# Altium schematic sheet 基板1.SchDoc
size A4
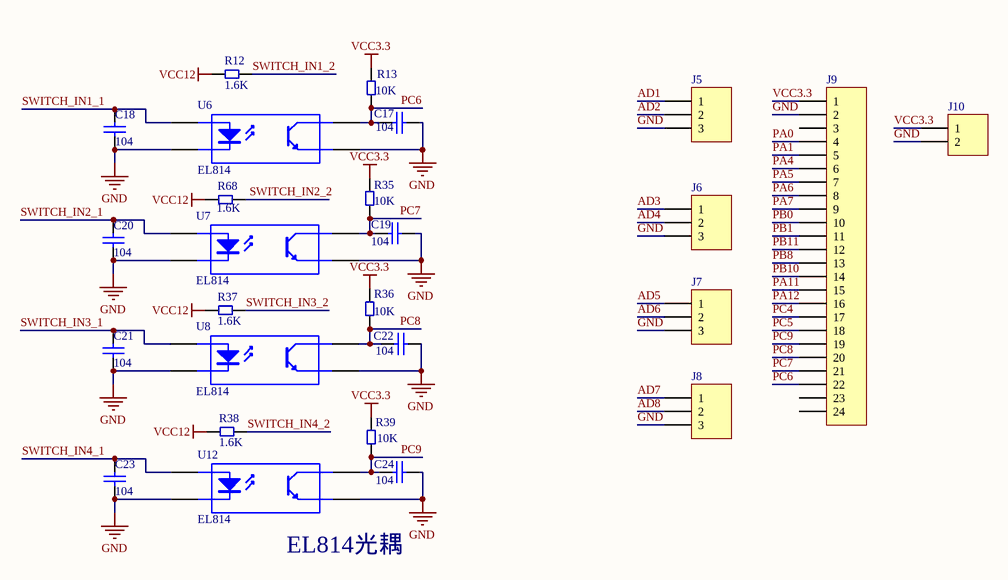
[diagram p0: 基板1.SchDoc]

## Parts
C17  value 104  [0805C]
C18  value 104  [0805C]
C19  value 104  [0805C]
C20  value 104  [0805C]
C21  value 104  [0805C]
C22  value 104  [0805C]
C23  value 104  [0805C]
C24  value 104  [0805C]
J5  Header 3  [J5_3P]  (value not drawn)
J6  Header 3  [J5_3P]  (value not drawn)
J7  Header 3  [J5_3P]  (value not drawn)
J8  Header 3  [J5_3P]  (value not drawn)
J9  Header 24  [ffc]  (value not drawn)
J10  Header 2  [HDR1X2]  (value not drawn)
R12  1.6K  [0805]
R13  10K  [0805]
R35  10K  [0805]
R36  10K  [0805]
R37  1.6K  [0805]
R38  1.6K  [0805]
R39  10K  [0805]
R68  1.6K  [0805]
U6  EL814  [SOP4]
U7  EL814  [SOP4]
U8  EL814  [SOP4]
U12  EL814  [SOP4]

## Nets
GND: C17.1 C18.1 C19.1 C20.1 C21.1 C22.1 C23.1 C24.1 J5.3 J6.3 J7.3 J8.3 J9.2 J10.2 U6.2(K) U6.3(E) U7.2(K) U7.3(E) U8.2(K) U8.3(E) U12.2(K) U12.3(E)
VCC3.3: J9.1 J10.1 R13.1 R35.1 R36.1 R39.1
VCC12: R12.1 R37.1 R38.1 R68.1
AD1: J5.1
AD2: J5.2
AD3: J6.1
AD4: J6.2
AD5: J7.1
AD6: J7.2
AD7: J8.1
AD8: J8.2
PA0: J9.4
PA1: J9.5
PA4: J9.6
PA5: J9.7
PA6: J9.8
PA7: J9.9
PA11: J9.15
PA12: J9.16
PB0: J9.10
PB1: J9.11
PB8: J9.13
PB10: J9.14
PB11: J9.12
PC4: J9.17
PC5: J9.18
PC6: C17.2 J9.22 R13.2 U6.4(C)
PC7: C19.2 J9.21 R35.2 U7.4(C)
PC8: C22.2 J9.20 R36.2 U8.4(C)
PC9: C24.2 J9.19 R39.2 U12.4(C)
SWITCH_IN1_1: C18.2 U6.1(A)
SWITCH_IN1_2: R12.2
SWITCH_IN2_1: C20.2 U7.1(A)
SWITCH_IN2_2: R68.2
SWITCH_IN3_1: C21.2 U8.1(A)
SWITCH_IN3_2: R37.2
SWITCH_IN4_1: C23.2 U12.1(A)
SWITCH_IN4_2: R38.2

Not connected (* = marked no-connect by the designer): J9 3 23 24

## Notes on the sheet
- Labels drawn without touching a wire or pin: EL814光耦

## Library data of the parts
C17-C24 = Cap: Capacitor; Published: 8-Jun-2000; LatestRevisionDate: 17-Jul-2002; LatestRevisionNote: Re-released for DXP Platform.; PackageReference: RAD-0.3; Publisher: Altium Limited; PackageDescription: Radial Cap, Thru-Hole; 2 Leads; 0.3 in Pin Spacing
J5-J8 = Header 3: Header, 3-Pin; LatestRevisionDate: 17-Jul-2002; LatestRevisionNote: Re-released for DXP Platform.; Publisher: Altium Limited
J9 = Header 24: Header, 24-Pin; LatestRevisionDate: 17-Jul-2002; LatestRevisionNote: Re-released for DXP Platform.; Publisher: Altium Limited
J10 = Header 2: Header, 2-Pin; LatestRevisionDate: 17-Jul-2002; LatestRevisionNote: Re-released for DXP Platform.; Publisher: Altium Limited
R12 R13 R35-R39 R68 = Res
U6-U8 U12 = TLP281